# Altium schematic sheet USB 2.0 High-Speed (OTG).SchDoc
size A3; SheetNumber: 10; SheetTotal: 11
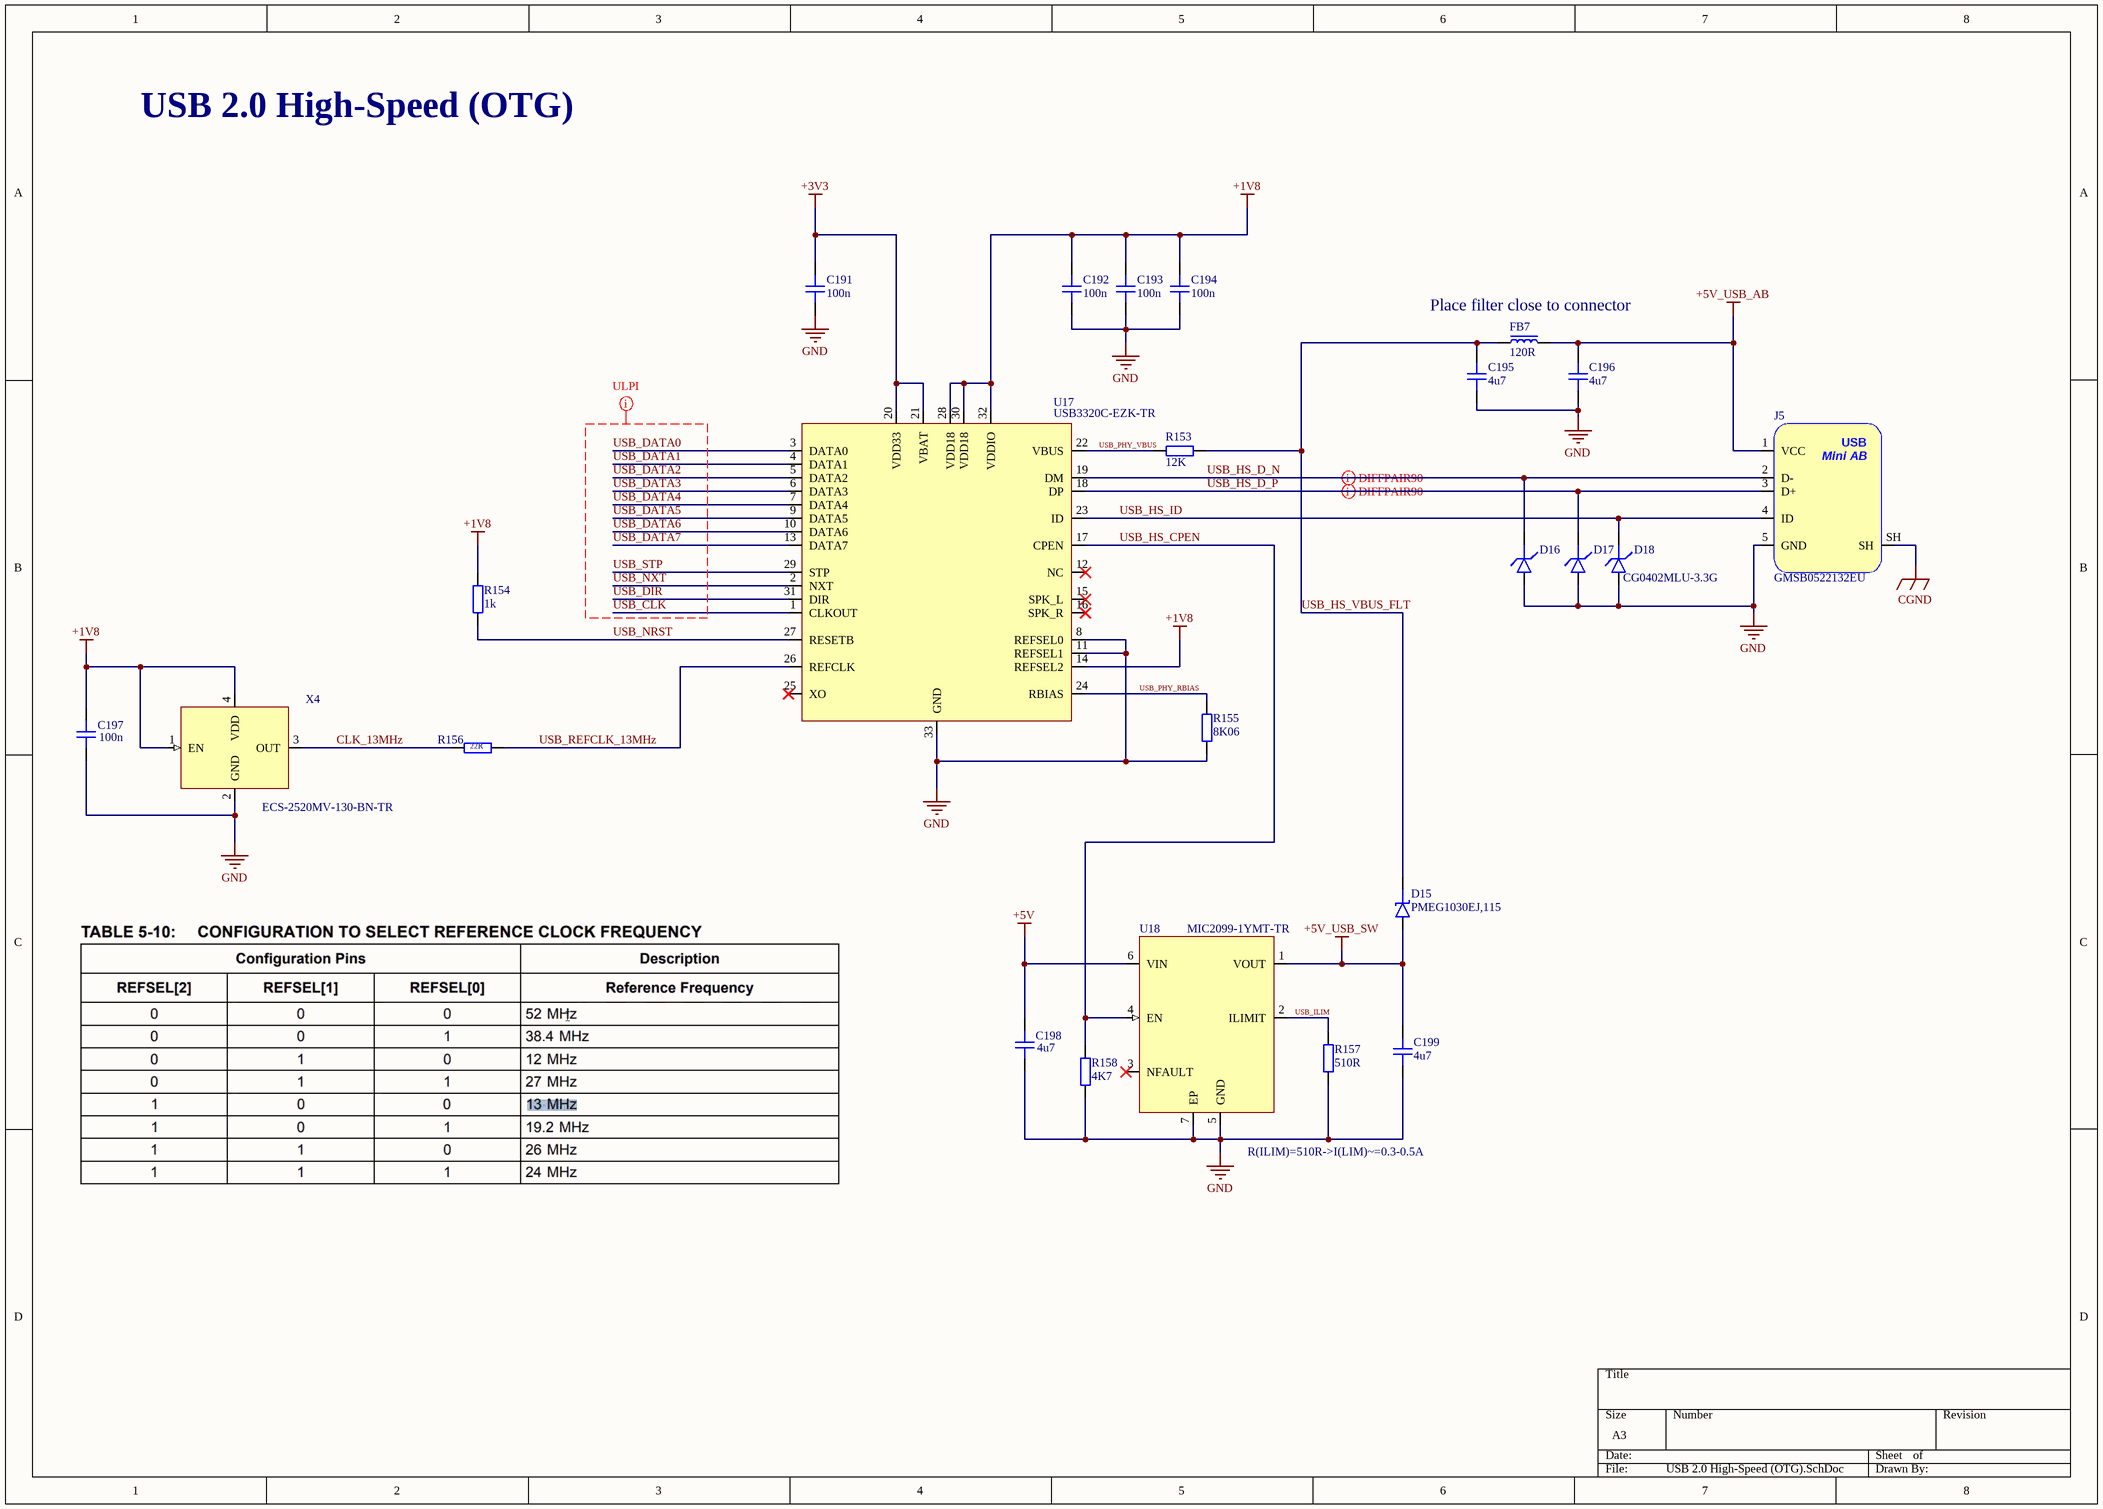
[diagram p0: USB 2.0 High-Speed (OTG).SchDoc]

## Parts
C191  100n  [CAP_0402]
C192  100n  [CAP_0402]
C193  100n  [CAP_0402]
C194  100n  [CAP_0402]
C195  4u7  [CAP_0402]
C196  4u7  [CAP_0402]
C197  value 100n  [CAP_0402]  (hidden comment: C0402)
C198  value 4u7  [CAP_0402]  (hidden comment: C0402)
C199  value 4u7  [CAP_0402]  (hidden comment: C0402)
D15  PMEG1030EJ,115  [SOD-323]
D16  D_TVS_0402  [D_0402]  (value not drawn)
D17  D_TVS_0402  [D_0402]  (value not drawn)
D18  Designator: CG0402MLU-3.3G  [D_0402]  (hidden comment: D_TVS_0402)
FB7  120R  [FB_0402]
J5  GMSB0522132EU  [GMSB0522132EU]
R153  value 12K  [RES_0402]  (hidden comment: R0402)
R154  value 1k  [RES_0402]  (hidden comment: R0402)
R155  value 8K06  [RES_0402]  (hidden comment: R0402)
R156  value 22R  [RES_0402]  (hidden comment: R0402)
R157  value 510R  [RES_0402]  (hidden comment: R0402)
R158  value 4K7  [RES_0402]  (hidden comment: R0402)
U17  USB3320C-EZK-TR  [QFN-32-5x5x0.85mm]
U18  MIC2099-1YMT-TR  [TMLF-6-1_6X1_6]
X4  ECS-2520MV-130-BN-TR  [XTAL_2520]

## Nets
+1V8: C192.2 C193.2 C194.2 C197.2 R154.1 U17.14(REFSEL2) U17.28(VDD18) U17.30(VDD18) U17.32(VDDIO) X4.1(EN) X4.4(VDD)
+3V3: C191.2 U17.20(VDD33) U17.21(VBAT)
+5V: C198.2 U18.6(VIN)
+5V_USB_AB: C196.2 FB7.2 J5.1(VCC)
+5V_USB_SW: C199.2 D15.A U18.1(VOUT)
CGND: J5.SH
GND: C191.1 C192.1 C193.1 C194.1 C195.1 C196.1 C197.1 C198.1 C199.1 D16.A D17.A D18.A J5.5(GND) R155.2 R157.2 R158.2 U17.8(REFSEL0) U17.11(REFSEL1) U17.33(GND) U18.5(GND) U18.7(EP) X4.2(GND)
CLK_13MHz: R156.2 X4.3(OUT)
USB_CLK: U17.1(CLKOUT)
USB_DATA0: U17.3(DATA0)
USB_DATA1: U17.4(DATA1)
USB_DATA2: U17.5(DATA2)
USB_DATA3: U17.6(DATA3)
USB_DATA4: U17.7(DATA4)
USB_DATA5: U17.9(DATA5)
USB_DATA6: U17.10(DATA6)
USB_DATA7: U17.13(DATA7)
USB_DIR: U17.31(DIR)
USB_HS_CPEN: R158.1 U17.17(CPEN) U18.4(EN)
USB_HS_D_N: D16.K J5.2(D-) U17.19(DM)
USB_HS_D_P: D17.K J5.3(D+) U17.18(DP)
USB_HS_ID: D18.K J5.4(ID) U17.23(ID)
USB_HS_VBUS_FLT: C195.2 D15.K FB7.1 R153.2
USB_ILIM: R157.1 U18.2(ILIMIT)
USB_NRST: R154.2 U17.27(RESETB)
USB_NXT: U17.2(NXT)
USB_PHY_RBIAS: R155.1 U17.24(RBIAS)
USB_PHY_VBUS: R153.1 U17.22(VBUS)
USB_REFCLK_13MHz: R156.1 U17.26(REFCLK)
USB_STP: U17.29(STP)

Not connected (* = marked no-connect by the designer): U17 12(NC)* 15(SPK_L)* 16(SPK_R)* 25(XO)*; U18 3(NFAULT)*

## Layout directives
differential pair; differential pair class 90OHM: USB_HS_D_N, USB_HS_D_P
net class ULPI; rule Matched Net Lengths [Delay Tolerance = 10ps]; rule Impedance Constraint [Min = 0.000    Max = 55.00    ]: USB_CLK, USB_DATA0, USB_DATA1, USB_DATA2, USB_DATA3, USB_DATA4, USB_DATA5, USB_DATA6, USB_DATA7, USB_DIR, USB_NXT, USB_STP

## Notes on the sheet
- USB 2.0 High-Speed (OTG)
- (near FB7) Place filter close to connector
- (near U18) R(ILIM)=510R->I(LIM)~=0.3-0.5A
- (in symbol GMSB0522132EU) USB; Mini AB

## Library data of the parts
C191-C199 = CAP_0402: Capacitor SMD 0402; Manufacturer: *; Manufacturer Part Number: *; Distributor Link: *; LCSC: *; Rating: *; Dielectric: *
  C191-C196: package: 0402
D15 = D_SCHOTTKY_SOD_323: Diode Schottky SMD SOD-323
D16 D17 = D_TVS_0402: Diode TVS / ESD 0402; Designator: CG0402MLU-3.3G
D18 = D_TVS_0402: Diode TVS / ESD 0402
FB7 = FB_0402: Ferrite Bead SMD 0402; Manufacturer: *; Manufacturer Part Number: *; Distributor Link: *; LCSC: *
J5 = GMSB0522132EU: USB 2.0 Mini AB Receptacle Right Angle Through-Hole; Manufacturer: Amphenol; Manufacturer Part Number: GMSB0522132EU
R153-R158 = RES_0402: Resistor SMD 0402; Manufacturer: *; Manufacturer Part Number: *; Distributor Link: *; LCSC: *
U17 = USB3320C-EZK-TR: Hi-Speed USB 2.0 ULPI Transceiver; Manufacturer: Microchip; Manufacturer Part Number: USB3320C-EZK-TR
U18 = MIC2099-1YMT-TR: Power Distribution Switch Resistor programmable current limit / – 0.1A to 1.1A 2.5V-5.5V; Manufacturer: Microchip; Manufacturer Part Number: MIC2099-1YMT-TR
X4 = ECS-2520MV-130-BN-TR: Standard Clock Oscillators XO (Standard),13MHz,Standby (Power Down),CMOS, Multi-Volt,1.6 V 3.6 V,+/-50ppm,-40 C 85 C,6mA,Surface Mount,4-SMD, No Lead,(2.50mm x 2.00mm),(0.80mm); Manufacturer: ECS; Manufacturer Part Number: ECS-2520MV-130-BN-TR